# EAGLE design psvemmc-v10 (EAGLE 8.4.3)
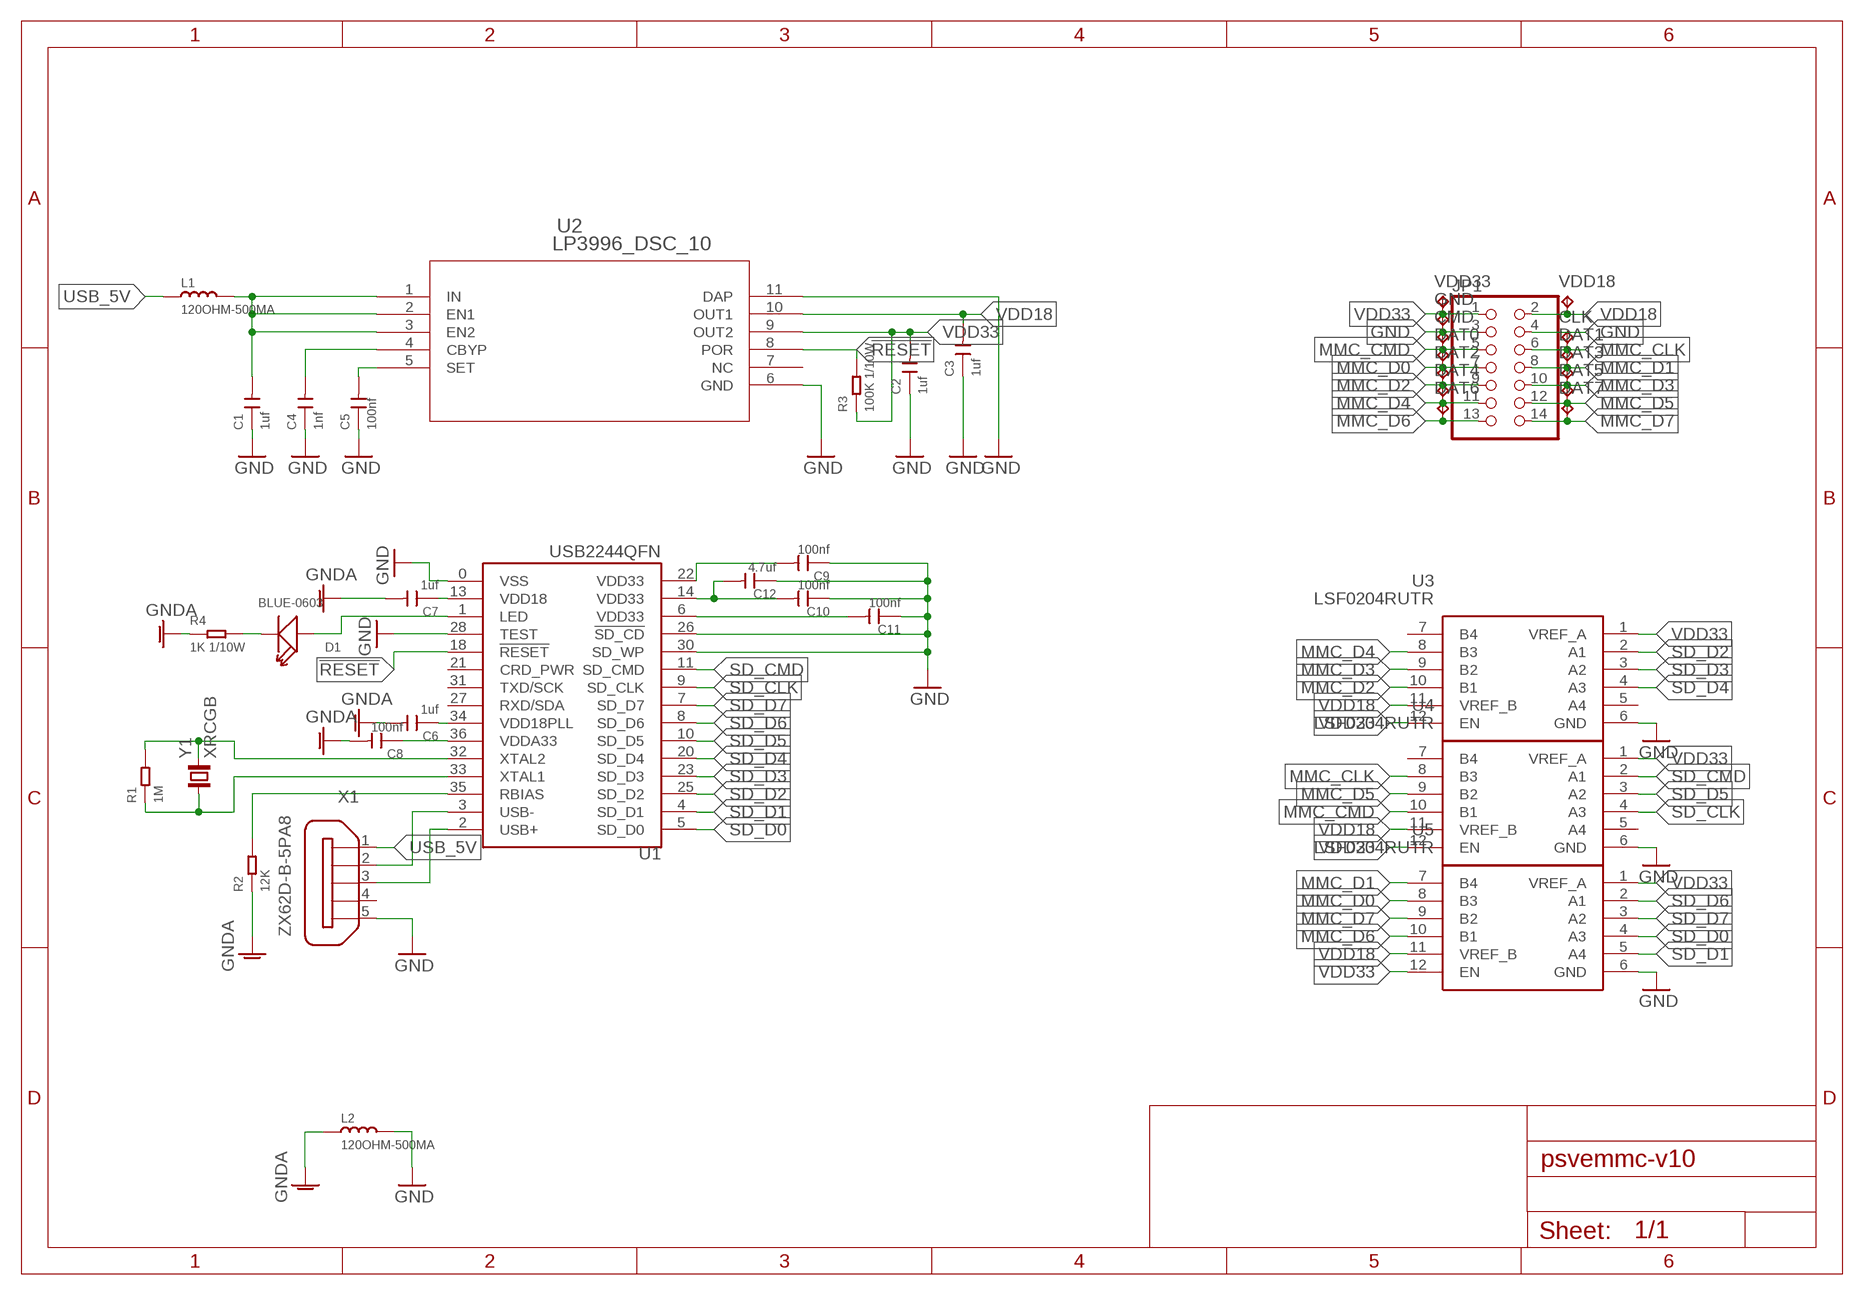
[diagram p0: schematic, sheet 1]

## Parts
C1  1uf  CERAMIC-1UF-25V-10%-X7R(0603)  [C0603]
C2  1uf  CERAMIC-1UF-25V-10%-X7R(0603)  [C0603]
C3  1uf  CERAMIC-1UF-25V-10%-X7R(0603)  [C0603]
C4  1nf  CERAMIC-1NF-50V-5%-C0G(0603)  [C0603]
C5  100nf  CERAMIC-100NF-50V-10%-X7R(0603)  [C0603]
C6  1uf  CERAMIC-1UF-25V-10%-X7R(0603)  [C0603]
C7  1uf  CERAMIC-1UF-25V-10%-X7R(0603)  [C0603]
C8  100nf  CERAMIC-100NF-50V-10%-X7R(0603)  [C0603]
C9  100nf  CERAMIC-100NF-50V-10%-X7R(0603)  [C0603]
C10  100nf  CERAMIC-100NF-50V-10%-X7R(0603)  [C0603]
C11  100nf  CERAMIC-100NF-50V-10%-X7R(0603)  [C0603]
C12  4.7uf  CERAMIC-4.7UF-10V-10%-X5R(0603)  [C0603]
CLK  TPTP20SQ  [TP20SQ]
CMD  TPTP20SQ  [TP20SQ]
D1  BLUE-0603  SMD-LED-CLEAR-BLUE(0603)  [LED-0603]
DAT0  TPTP20SQ  [TP20SQ]
DAT1  TPTP20SQ  [TP20SQ]
DAT2  TPTP20SQ  [TP20SQ]
DAT3  TPTP20SQ  [TP20SQ]
DAT4  TPTP20SQ  [TP20SQ]
DAT5  TPTP20SQ  [TP20SQ]
DAT6  TPTP20SQ  [TP20SQ]
DAT7  TPTP20SQ  [TP20SQ]
GND  TPTP20SQ  [TP20SQ]
JP1  PINHD-2X7  [2X07]
L1  120OHM-500MA  SMD-FERRITE-CHIP-120-OHM-500MA(0603)  [L0603]
L2  120OHM-500MA  SMD-FERRITE-CHIP-120-OHM-500MA(0603)  [L0603]
R1  1M  SMD-RES-1M-1%-1/10W(0603)  [R0603]
R2  12K  SMD-RES-12K-1%-1/10W(0603)  [R0603]
R3  100K 1/10W  SMD-RES-100K-5%-1/10W(0603)  [R0603]
R4  1K 1/10W  SMD-RES-1K-5%-1/10W(0603)  [R0603]
U1  USB2244QFN  [QFN36]
U2  LP3996_DSC_10  [SDA10A]
U3  LSF0204RUTR  [RUT(R-PUQFN-N12)]
U4  LSF0204RUTR  [RUT(R-PUQFN-N12)]
U5  LSF0204RUTR  [RUT(R-PUQFN-N12)]
VDD18  TPTP20SQ  [TP20SQ]
VDD33  TPTP20SQ  [TP20SQ]
X1  ZX62D-B-5PA8  [ZX62D-B-5PA8]
Y1  XRCGB  [XRCGB]

## Nets
!RESET: R3.2 U1.18(!RESET) U2.8(POR)
GND [GND]: C1.1 C2.1 C3.1 C4.1 C5.1 C9.1 C10.1 C11.1 C12.1 GND.TP JP1.3 JP1.4 L2.2 U1.0(VSS) U1.26(!SD_CD) U1.28(TEST) U1.30(SD_WP) U2.6(GND) U2.11(DAP) U3.6(GND) U4.6(GND) U5.6(GND) X1.5
GNDA: C6.2 C7.2 C8.2 L2.1 R2.1 R4.1
LED: D1.+ U1.1(LED)
LED_M: D1.- R4.2
MMC_CLK: CLK.TP JP1.6 U4.8(B3)
MMC_CMD: CMD.TP JP1.5 U4.10(B1)
MMC_D0: DAT0.TP JP1.7 U5.8(B3)
MMC_D1: DAT1.TP JP1.8 U5.7(B4)
MMC_D2: DAT2.TP JP1.9 U3.10(B1)
MMC_D3: DAT3.TP JP1.10 U3.9(B2)
MMC_D4: DAT4.TP JP1.11 U3.8(B3)
MMC_D5: DAT5.TP JP1.12 U4.9(B2)
MMC_D6: DAT6.TP JP1.13 U5.10(B1)
MMC_D7: DAT7.TP JP1.14 U5.9(B2)
N$2: C4.2 U2.4(CBYP)
RBIAS: R2.2 U1.35(RBIAS)
SD_CLK: U1.9(SD_CLK) U4.4(A3)
SD_CMD: U1.11(SD_CMD) U4.2(A1)
SD_D0: U1.5(SD_D0) U5.4(A3)
SD_D1: U1.4(SD_D1) U5.5(A4)
SD_D2: U1.25(SD_D2) U3.2(A1)
SD_D3: U1.23(SD_D3) U3.3(A2)
SD_D4: U1.20(SD_D4) U3.4(A3)
SD_D5: U1.10(SD_D5) U4.3(A2)
SD_D6: U1.8(SD_D6) U5.2(A1)
SD_D7: U1.7(SD_D7) U5.3(A2)
SET: C5.2 U2.5(SET)
USB_5V: L1.1 X1.1
USB_M [USB]: U1.3(USB-) X1.2
USB_P [USB]: U1.2(USB+) X1.3
VDD5: C1.2 L1.2 U2.1(IN) U2.2(EN1) U2.3(EN2)
VDD18: C3.2 JP1.2 U2.10(OUT1) U3.11(VREF_B) U4.11(VREF_B) U5.11(VREF_B) VDD18.TP
VDD18_PLL: C6.1 U1.34(VDD18PLL)
VDD18_USB: C7.1 U1.13(VDD18)
VDD33: C2.2 C8.1 C9.2 C10.2 C11.2 C12.2 JP1.1 R3.1 U1.6(VDD33) U1.14(VDD33) U1.22(VDD33) U1.36(VDDA33) U2.9(OUT2) U3.1(VREF_A) U3.12(EN) U4.1(VREF_A) U4.12(EN) U5.1(VREF_A) U5.12(EN) VDD33.TP
XTAL1: R1.1 U1.33(XTAL1) Y1.1
XTAL2: R1.2 U1.32(XTAL2) Y1.3
Unconnected: U1.21(CRD_PWR) U1.27(RXD/SDA) U1.31(TXD/SCK) U2.7(NC) U3.5(A4) U3.7(B4) U4.5(A4) U4.7(B4) X1.4 X1.S1 X1.S2 X1.S3 X1.S4

## Library data of the parts
C1-C3 C6 C7 = Seeed-Capacitor:CERAMIC-1UF-25V-10%-X7R(0603): 302010139; MPN: CC0603KRX7R8BB105
C4 = Seeed-Capacitor:CERAMIC-1NF-50V-5%-C0G(0603): 302010341; MPN: GRM1885C1H102JA01D
C5 C8-C11 = Seeed-Capacitor:CERAMIC-100NF-50V-10%-X7R(0603): 302010138; MPN: CC0603KRX7R9BB104
C12 = Seeed-Capacitor:CERAMIC-4.7UF-10V-10%-X5R(0603): 302010111; MPN: CC0603KRX5R6BB475
CLK CMD DAT0 DAT1-DAT7 GND VDD18 VDD33 = testpad:TP: Test pad
D1 = Seeed-LED:SMD-LED-CLEAR-BLUE(0603): 304090045; MPN: 19-217-BHC-ZL1M2RY-3T
JP1 = pinhead:PINHD-2X7: PIN HEADER
L1 L2 = Seeed-Inductor:SMD-FERRITE-CHIP-120-OHM-500MA(0603): 303030001; MPN: BLM18AG121SN1D
R1 = Seeed-Resistor:SMD-RES-1M-1%-1/10W(0603): 301010151; MPN: RC0603FR-071ML
R2 = Seeed-Resistor:SMD-RES-12K-1%-1/10W(0603): 301010102; MPN: RC0603FR-0712KL
R3 = Seeed-Resistor:SMD-RES-100K-5%-1/10W(0603): 301010089; MPN: RC0603JR-07100KL
R4 = Seeed-Resistor:SMD-RES-1K-5%-1/10W(0603): 301010291; MPN: RC0603JR-071KL
U1 = USB2244:USB2244: USB2244/USB2244I
U2 = LP3996:LP3996_DSC_10; BASE_PN: LP3996; COMP: TypeLDO; LIBRARY: ReferenceLP3996SD; PARTNUMBER: LP3996SD0833; PIN: Count10; SYMBOL: NameLP3996SD0833; TYPE: LP3996SD0833; VENDOR: NationalSemiconductor; VERSION: 1
U3-U5 = LSF0204RUTR:LSF0204RUTR: 4-Bit Bidirectional Multi-Voltage Level Translator for Open-Drain & Push- Pull Source: Datasheet <http://www.ti.com/lit/gpn/lsf0204>; DESCRIPTION: 4-Bit Bidirectional Multi-Voltage Level Translator for Open-Drain & Push- Pull; HEIGHT: mm; MANUFACTURER_NAME: Texas Instruments; MANUFACTURER_PART_NUMBER: LSF0204RUTR; SUPPLIER_NAME: RS
X1 = zx62d-b-5pa8-oshpark_10:ZX62D-B-5PA8: Micro USB Type B Connector - Standard, Shell Through Hole Source: http://www.hirose.co.jp/cataloge_hp/ed_ZX_20140804.pdf; MF: Hirose; MPN: ZX62D-B-5PA8; OC_FARNELL: 2300438; OC_NEWARK: 69W0712
Y1 = crystal:XRCGB: CRYSTAL

## Net classes
1 USB: clearance 0.508 mm to class 0
2 GND: clearance 0.508 mm to class 1

## Board
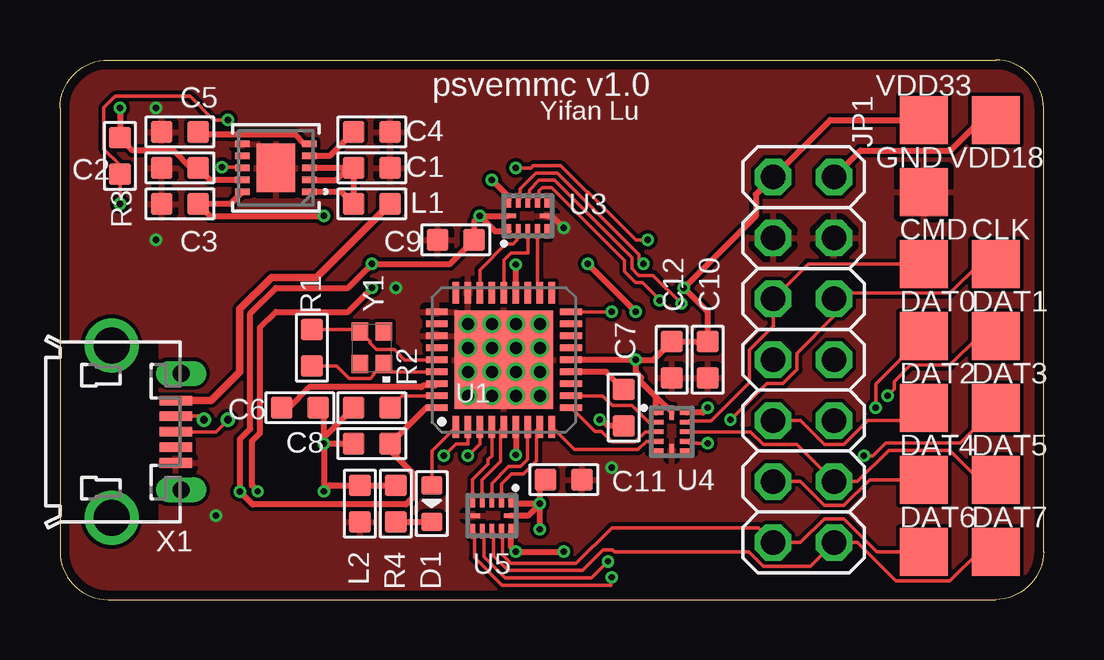
[diagram p1: board, top side]
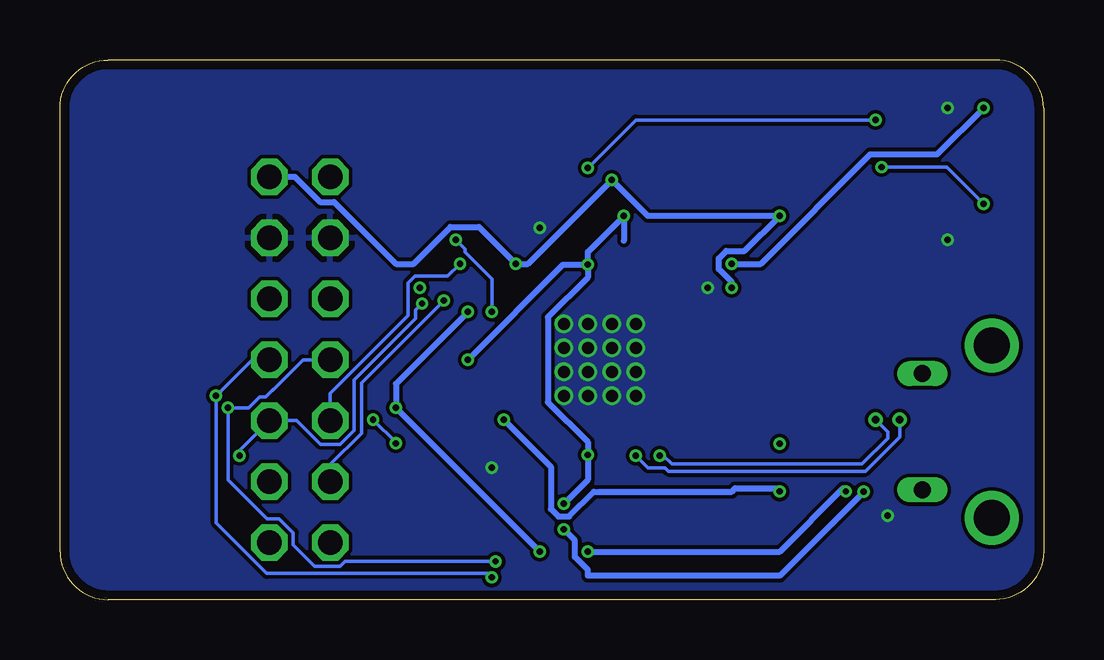
[diagram p2: board, bottom side, seen from below]

Size 41 x 22.5 mm. Coordinates in mm from the lower left corner, seen from the top.
Outline: 2,0 39,0 arc90 41,2 41,20.5 arc90 39,22.5 2,22.5 arc90 0,20.5 0,2 arc90 2,0
Copper layers (1*16): Top 0.035559375mm / dielectric 1.6mm / Bottom 0.035559375mm
Design rules "oshpark-2layer *": minimum track width 6mil, minimum drill 10mil, track to track 6mil, track to pad 6mil, pad to pad 6mil, via to via 6mil, smd to smd 6mil, copper to edge 15mil, drill to drill 6mil, minimum pad ring 5mil, minimum via ring 5mil, stop-mask expansion 2.5mil, vias tented up to drill 0mil, thermal gap 10mil
tKeepout: area 25,15 to 28,22

### Footprints (pad centres in the part's own frame; a part is rotated, then mirrored left to right if it is on the bottom)
C0603 = smd 0.889 x 0.889: 1 0,0.762; 2 0,-0.762
TP20SQ = smd 2 x 2: TP 0,0
LED-0603 = smd 0.762 x 0.889: + -0.762,0; - 0.762,0
2X07 = drill 1.016 octagon: 1 -7.62,-1.27; 2 -7.62,1.27; 3 -5.08,-1.27; 4 -5.08,1.27; 5 -2.54,-1.27; 6 -2.54,1.27; 7 0,-1.27; 8 0,1.27; 9 2.54,-1.27; 10 2.54,1.27; 11 5.08,-1.27; 12 5.08,1.27; 13 7.62,-1.27; 14 7.62,1.27
L0603 = smd 0.889 x 0.889: 1 -0.762,0; 2 0.762,0
R0603 = smd 0.889 x 0.889: 1 0,0.762; 2 0,-0.762
QFN36 = smd 4.1 x 4.1: 0 0,0 | smd 0.28 x 0.9: 1 -2,-2.8; 2 -1.5,-2.8; 3 -1,-2.8; 4 -0.5,-2.8; 5 0,-2.8; 6 0.5,-2.8; 7 1,-2.8; 8 1.5,-2.8; 9 2,-2.8; 19 2,2.8; 20 1.5,2.8; 21 1,2.8; 22 0.5,2.8; 23 0,2.8; 24 -0.5,2.8; 25 -1,2.8; 26 -1.5,2.8; 27 -2,2.8 | smd 0.9 x 0.28: 10 2.8,-2; 11 2.8,-1.5; 12 2.8,-1; 13 2.8,-0.5; 14 2.8,0; 15 2.8,0.5; 16 2.8,1; 17 2.8,1.5; 18 2.8,2; 28 -2.8,2; 29 -2.8,1.5; 30 -2.8,1; 31 -2.8,0.5; 32 -2.8,0; 33 -2.8,-0.5; 34 -2.8,-1; 35 -2.8,-1.5; 36 -2.8,-2
SDA10A = smd 0.61 x 0.254: 1 -1.397,1; 2 -1.397,0.5; 3 -1.397,0; 4 -1.397,-0.5; 5 -1.397,-1; 6 1.397,-1; 7 1.397,-0.5; 8 1.397,0; 9 1.397,0.5; 10 1.397,1 | smd 1.6 x 2.007: 11 0,0
RUT(R-PUQFN-N12) = smd 0.2 x 0.6: 1 -0.8,-0.65; 2 -0.4,-0.65; 3 0,-0.65; 4 0.4,-0.65; 5 0.8,-0.65; 7 0.8,0.65; 8 0.4,0.65; 9 0,0.65; 10 -0.4,0.65; 11 -0.8,0.65 | smd 0.6 x 0.2: 6 0.8,0; 12 -0.8,0
ZX62D-B-5PA8 = smd 1.35 x 0.4: 1 4.825,1.3; 2 4.825,0.65; 3 4.825,0; 4 4.825,-0.65; 5 4.825,-1.3 | drill 1.5: S1 2.15,-3.6; S2 2.15,3.6 | drill 0.7 long: S3 5.05,2.425; S4 5.05,-2.425
XRCGB = smd 0.75 x 0.7: 1 -0.675,-0.5; 2 0.675,-0.5; 3 0.675,0.5; 4 -0.675,0.5

### Placement (x,y rotation side)
C1  13,18 270 top
C2  5,18 90 top
C3  5,16.5 90 top
C4  13,19.5 270 top
C5  5,19.5 90 top
C6  10,8 90 top
C7  23.5,8 0 top
C8  13,6.5 270 top
C9  16.5,15 90 top
C10  27,10 180 top
C11  21,5 270 top
C12  25.5,10 180 top
CLK  39,14 0 top
CMD  36,14 0 top
D1  15.5,4 270 top
DAT0  36,11 0 top
DAT1  39,11 0 top
DAT2  36,8 0 top
DAT3  39,8 0 top
DAT4  36,5 0 top
DAT5  39,5 0 top
DAT6  36,2 0 top
DAT7  39,2 0 top
GND  36,17 0 top
JP1  31,10 270 top
L1  13,16.5 180 top
L2  12.5,4 270 top
R1  10.5,10.5 180 top
R2  13,8 90 top
R3  2.5,18.5 0 top
R4  14,4 0 top
U1  18.5,10 0 top
U2  9,18 180 top
U3  19.5,16 0 top
U4  25.5,7 270 top
U5  18,3.5 180 top
VDD18  39,20 0 top
VDD33  36,20 0 top
X1  0,7 0 top
Y1  13,10.5 90 top

### Tracks (layer width: path | path; a pad name or v marks a point on that pad's centre or on a via)
!RESET  (via drill 0.25)
  Top 0.152: U2.8 7.57,18.03 v6.75,18.03 | R3.2 v2.5,16.5 2.5,18.11 1.83,18.79 1.83,20.51 2.3,20.98 5.43,20.98 6.41,20 v7,20 | U1.18 v23,12 | v24.5,15 24,15 22,17 21.97,17 20.87,18.09 19.73,18.09 19.63,18 v19,18
  Bottom 0.152: v6.75,18.03 4.03,18.03 v2.5,16.5 | v23,12 23,13.36 24.12,14.48 24.12,14.62 v24.5,15 | v19,18 17,20 v7,20
GND  (via drill 0.25, 0.5)
  Top 0.254: U3.6 20.5,16 v21,15.5 | U1.0 v19,9.5
  other vias: 17,11.5 18,11.5 19,11.5 20,11.5 20,10.5 19,10.5 18,10.5 17,10.5 17,9.5 18,9.5 20,9.5 20,8.5 19,8.5 18,8.5 17,8.5 14,13 4,20.5 23,5.5 6.5,3.5 4,15
  pour Top (rank 5): 0,22.5 0,0 41,0 41,22.5
  pour Bottom: 0,22.5 0,0 41,0 41,22.5
GNDA  (via drill 0.25)
  Top 0.254: C6.2 11,7.76 v11,6.5 | R2.1 11,6.76 v11,6.5 | C8.2 v11,6.5 | 13.74,4.5 R4.1 L2.1 11.25,4.76 v11,4.51 v11,6.5 | C7.2 22.86,7.24 22.72,7.37 22.63,7.37 v22.5,7.5
  Bottom 0.254: v22.5,7.5 20.53,5.53 20.53,3.78 20.22,3.47 19.78,3.47 18.75,4.5 13,4.5 12.86,4.64 11,4.64 v11,4.51
  pour Bottom (rank 3): 8.5,12 15.5,12 15.5,7 18.5,7 18.5,4 8.5,4
LED
  Top 0.152: U1.1 15.5,6.2 D1.+
LED_M
  Top 0.254: R4.2 D1.-
MMC_CLK  (via drill 0.25)
  Top 0.152: U4.8 26.22,6.53 26.55,6.53 26.56,6.52 v27,6.52 | CLK.TP 38.32,14 37.09,12.77 32.5,12.77 JP1.6 32.27,11.82 30.72,10.27 30.72,9.59 30.14,9.01 29.46,9.01 v27.95,7.5
  Bottom 0.152: v27,6.52 27,6.55 v27.95,7.5
MMC_CMD
  Top 0.152: U4.10 26.19,7.44 27.13,7.44 28.74,9.06 28.74,10.41 29.73,11.4 JP1.5 31.19,14 CMD.TP
MMC_D0  (via drill 0.25)
  Top 0.152: U5.8 17.67,2.78 17.67,1.78 18.55,0.91 22.16,0.91 v22.84,1.59 | v34,8 34,9 DAT0.TP
  Bottom 0.152: v22.84,1.59 29.12,1.59 29.32,1.39 30.39,1.39 31.28,2.28 31.28,2.79 31.86,3.37 32.37,3.37 34,5 v34,8 33.13,8 32.68,8.45 32.42,8.45 31.93,8.94 | JP1.7 30.87,10 31.93,8.94 | 31.93,8.94 32.19,8.68
MMC_D1  (via drill 0.25)
  Top 0.152: U5.7 17.27,2.78 17.27,1.75 18.42,0.6 22.96,0.6 22.96,0.89 v23,0.93 | v34.5,8.5 34.77,8.77 34.77,9.1 35.45,9.77 37.09,9.77 38.32,11 DAT1.TP
  Bottom 0.152: v23,0.93 23.16,1.08 32.38,1.08 34.48,3.19 34.48,8.48 v34.5,8.5 33,10 JP1.8
MMC_D2  (via drill 0.25)
  Top 0.152: v24.32,14 24.14,14.18 24.14,14.39 20.75,17.79 19.85,17.79 19.17,17.11 19.17,16.72 U3.10 | DAT2.TP 35.46,7.46 33.67,7.46 32.68,6.47 31.86,6.47 30.87,7.46 JP1.9
  Bottom 0.152: JP1.9 29.73,8.59 26.48,11.84 26.48,13.2 26.2,13.48 24.84,13.48 v24.32,14
MMC_D3  (via drill 0.25)
  Top 0.152: U3.9 19.57,16.72 19.57,17.08 19.98,17.48 20.62,17.48 23.84,14.27 23.84,13.8 24.12,13.52 24.73,13.52 v25.91,12.34 | 38.32,8 DAT3.TP 37.53,6.53 34.42,6.53 33.89,6 v33.52,6
  Bottom 0.152: v25.91,12.34 26.18,12.07 26.18,11.71 28.74,9.15 28.74,7.05 29.32,6.47 30.14,6.47 31.13,7.46 JP1.10 33.52,6.21 v33.52,6
MMC_D4  (via drill 0.25)
  Top 0.152: U3.8 19.97,16.72 19.97,17.05 20.11,17.18 20.5,17.18 23.53,14.14 23.53,13.67 24,13.21 24.29,13.21 25,12.5 v25,12.47 | DAT4.TP 33.75,5 32.68,3.93 31.86,3.93 30.87,4.92 JP1.11
  Bottom 0.152: v25,12.47 25.87,11.59 28.43,9.02 28.43,6.92 29.73,5.63 JP1.11
MMC_D5
  Top 0.152: U4.9 28.79,7 29.32,6.47 30.72,6.47 JP1.12 33.24,4.92 34.55,6.23 37.09,6.23 38.32,5 DAT5.TP
MMC_D6
  Top 0.152: U5.10 18.44,2.81 18.44,1.87 18.8,1.52 21,1.52 | 21,1.52 21.2,1.52 | 21,1.52 21.52,1.52 23,3 29.11,3 JP1.13 30.87,2.38 31.86,3.37 32.68,3.37 34.05,2 DAT6.TP
MMC_D7
  Top 0.152: U5.9 18.07,2.78 18.07,1.81 18.67,1.21 21.78,1.21 22.64,2.07 23.04,2.07 23.11,2 28.71,2 29.32,1.39 31.28,1.39 JP1.14 33.24,2.38 34.85,0.77 37.09,0.77 38.32,2 DAT7.TP
N$2
  Top 0.254: C4.2 11.24,18.5 U2.4
RBIAS
  Top 0.152: R2.2 14.26,8.5 U1.35
SD_CLK
  Top 0.152: U4.4 24.44,6.6 24.1,6.26 21.44,6.26 U1.9
SD_CMD
  Top 0.152: U1.11 22.61,8.5 23.03,8.09 23.84,8.09 24.53,7.4 U4.2
SD_D0
  Top 0.152: U1.5 18.37,7.07 18.37,5.75 17.6,4.98 U5.4
SD_D1
  Top 0.152: U1.4 18,6 17.84,5.84 17.84,5.65 17.2,5.01 U5.5
SD_D2
  Top 0.152: U3.2 19.06,15.31 19.06,14.98 18.89,14.82 18.57,14.82 17.5,13.75 U1.25
SD_D3
  Top 0.152: U1.23 18.52,12.82 18.52,14.16 18.8,14.45 19.5,14.45 U3.3
SD_D4
  Top 0.152: U3.4 19.9,12.9 U1.20
SD_D5
  Top 0.152: U4.3 24.41,7 23.97,6.57 23.03,6.57 22.57,7.02 22.3,7.02 21.32,8 U1.10
SD_D6
  Top 0.152: U5.2 18.4,4.82 18.83,5.25 19.33,5.25 19.87,5.79 19.87,7.07 U1.8
SD_D7
  Top 0.152: U1.7 19.48,7.18 19.48,5.83 19.2,5.55 18.7,5.55 18,4.85 U5.3
SET
  Top 0.254: U2.5 10.2,19 9.79,19.41 5.86,19.41 C5.2
USB_5V
  Top 0.305: X1.1 6.3,8.3 7.5,9.49 7.5,12.11 8.82,13.43 10.69,13.43 11.63,14.37 | 11.63,14.37 11.26,14 | 11.63,14.37 L1.1
USB_M  (via drill 0.25, 0.33)
  Top 0.152: v17,6 17.5,6.5 U1.3 | X1.2 5.85,7.65 v6,7.5
  Bottom 0.152: v17,6 16.5,5.5 15.78,5.5 15.63,5.35 7.44,5.35 | 7.44,5.35 | v6,7.5 6,6.78 7.44,5.35
USB_P  (via drill 0.25, 0.33)
  Top 0.152: v16,6 16.5,6.5 17,6.5 U1.2 | X1.3 6.5,7 v7,7.5
  Bottom 0.152: v16,6 15.85,6 15.5,5.65 7.56,5.65 6.5,6.72 6.5,7 v7,7.5
VDD5
  Top 0.254: U2.1 11.74,17 L1.2 C1.2 12,18 | 12,18 U2.3 | U2.2 11.5,17.5 12,18
VDD18  (via drill 0.25)
  Top 0.254: U2.10 7.1,16.5 C3.2 6.26,16 v11,16 | v18,17.5 18.7,16.8 U3.11 | v24,12 v22,14 | v27,8 26.8,7.8 U4.11 | U5.11 18.8,2.2 v19,2 v21,2 | v13,13 12,12 9,12 8.33,11.33 8.33,6.95 8,6.61 8,4.75 v8.24,4.51 | VDD18.TP 38.4,20 37.12,18.72 33.37,18.72 JP1.2
  Bottom 0.254: v24,12 27,9 v27,8 v21,2 | v13,13 13,13.25 13.53,13.78 13.53,14.22 13.22,14.53 12.47,14.53 v11,16 16.5,16 v18,17.5 21.5,14 v22,14 23.53,15.53 24.72,15.53 26.25,14 27,14 29.58,16.58 30.16,16.58 31.2,17.62 JP1.2 | v19,2 11,2 8.36,4.64 v8.24,4.52 v8.24,4.51
VDD18_PLL
  Top 0.254: 9.54,8 C6.1 9.54,8 | U1.34 15.62,8.92 15.13,8.92 15.07,8.86 10.4,8.86 9.54,8
VDD18_USB
  Top 0.254: C7.1 22.76,9.5 U1.13
VDD33  (via drill 0.25)
  Top 0.254: U2.9 6.26,17.5 C2.2 5.46,18 4.73,18.72 3.04,18.72 R3.1 v2.5,20.5 | U1.36 15.26,8 C8.1 13.76,6.22 14.72,5.26 14.72,4.27 14.42,3.97 8.03,3.97 v7.5,4.5 7.5,6.69 7.93,7.12 7.93,11.93 9,13 12,13 v13,14 16.26,14 C9.2 17.26,15.76 v17.5,16 | v24,10 24.74,10 C12.2 C10.2 27,12 v26,13 29,16 29,16.89 JP1.1 32.11,20 VDD33.TP | v24,10 U1.14 | U1.6 v19,6.04 | v20,4 20,4.76 C11.2 | U1.22 v19,13.96 | v17.5,16 U3.12 | v17.5,16 18.15,15.35 U3.1 | v20,4 19.5,3.5 U5.12 | v20,4 18.95,4 U5.1 | v20,2.93 v20,4 | 24.85,8.45 U4.12 | v24,10 24,9.48 24.22,9.26 24.22,9.08 24.85,8.45 | U4.1 24.85,8.45
  Bottom 0.254: v20,4 19,5 v19,6.04 19,6.57 20.66,8.23 20.66,11.77 19,13.43 v19,13.96 | 17.5,14.96 v17.5,16 19,14.5 v19,13.96 | v7.5,4.5 11,1 19,1 19,1.25 19.53,1.78 19.53,2.47 v20,2.93 | v2.5,20.5 4.43,18.57 7.22,18.57 11.79,14 v13,14 | v19,13.96 20.04,13.96 v24,10
XTAL1
  Top 0.152: U1.33 13.82,9.5 Y1.1 13.08,9.4 13.08,9.36 12.95,9.22 12.05,9.22 11.54,9.74 R1.1
XTAL2
  Top 0.152: U1.32 14.37,10 13.95,10.43 13.2,10.43 12.92,10.71 12.92,10.75 Y1.3 12.41,11.26 R1.2

### Text on the board
tPlace: psvemmc v1.0 | Yifan Lu